# EAGLE design perfScm (EAGLE 9.2.2)
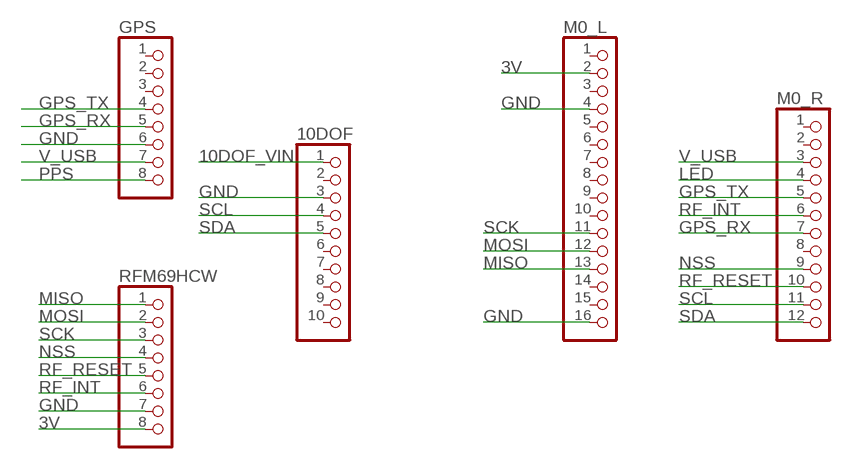
[diagram p0: schematic, sheet 1]

## Parts
10DOF  PINHD-1X10  [1X10]
GPS  PINHD-1X8  [1X08]
M0_L  PINHD-1X16  [1X16]
M0_R  PINHD-1X12  [1X12]
RFM69HCW  PINHD-1X8  [1X08]

## Nets
3V: M0_L.2 RFM69HCW.8
10DOF_VIN: 10DOF.1
GND: 10DOF.3 GPS.6 M0_L.4 M0_L.16 RFM69HCW.7
GPS_RX: GPS.5 M0_R.7
GPS_TX: GPS.4 M0_R.5
LED: M0_R.4
MISO: M0_L.13 RFM69HCW.1
MOSI: M0_L.12 RFM69HCW.2
NSS: M0_R.9 RFM69HCW.4
PPS: GPS.8
RF_INT: M0_R.6 RFM69HCW.6
RF_RESET: M0_R.10 RFM69HCW.5
SCK: M0_L.11 RFM69HCW.3
SCL: 10DOF.4 M0_R.11
SDA: 10DOF.5 M0_R.12
V_USB: GPS.7 M0_R.3
Unconnected: 10DOF.2 10DOF.6 10DOF.7 10DOF.8 10DOF.9 10DOF.10 GPS.1 GPS.2 GPS.3 M0_L.1 M0_L.3 M0_L.5 M0_L.6 M0_L.7 M0_L.8 M0_L.9 M0_L.10 M0_L.14 M0_L.15 M0_R.1 M0_R.2 M0_R.8

## Library data of the parts
10DOF = pinhead:PINHD-1X10: PIN HEADER
GPS RFM69HCW = pinhead:PINHD-1X8: PIN HEADER
M0_L = pinhead:PINHD-1X16: PIN HEADER
M0_R = pinhead:PINHD-1X12: PIN HEADER

## Board
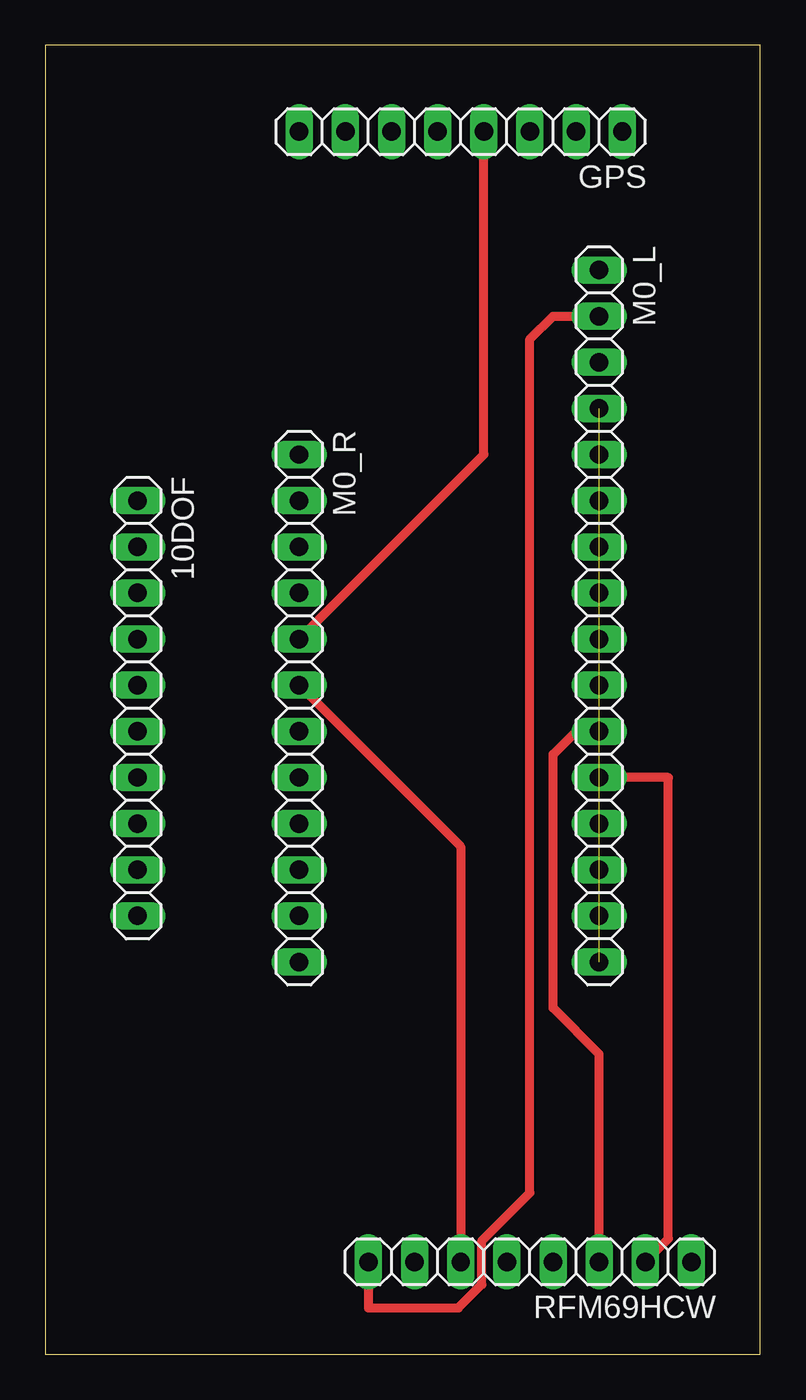
[diagram p1: board, top side]
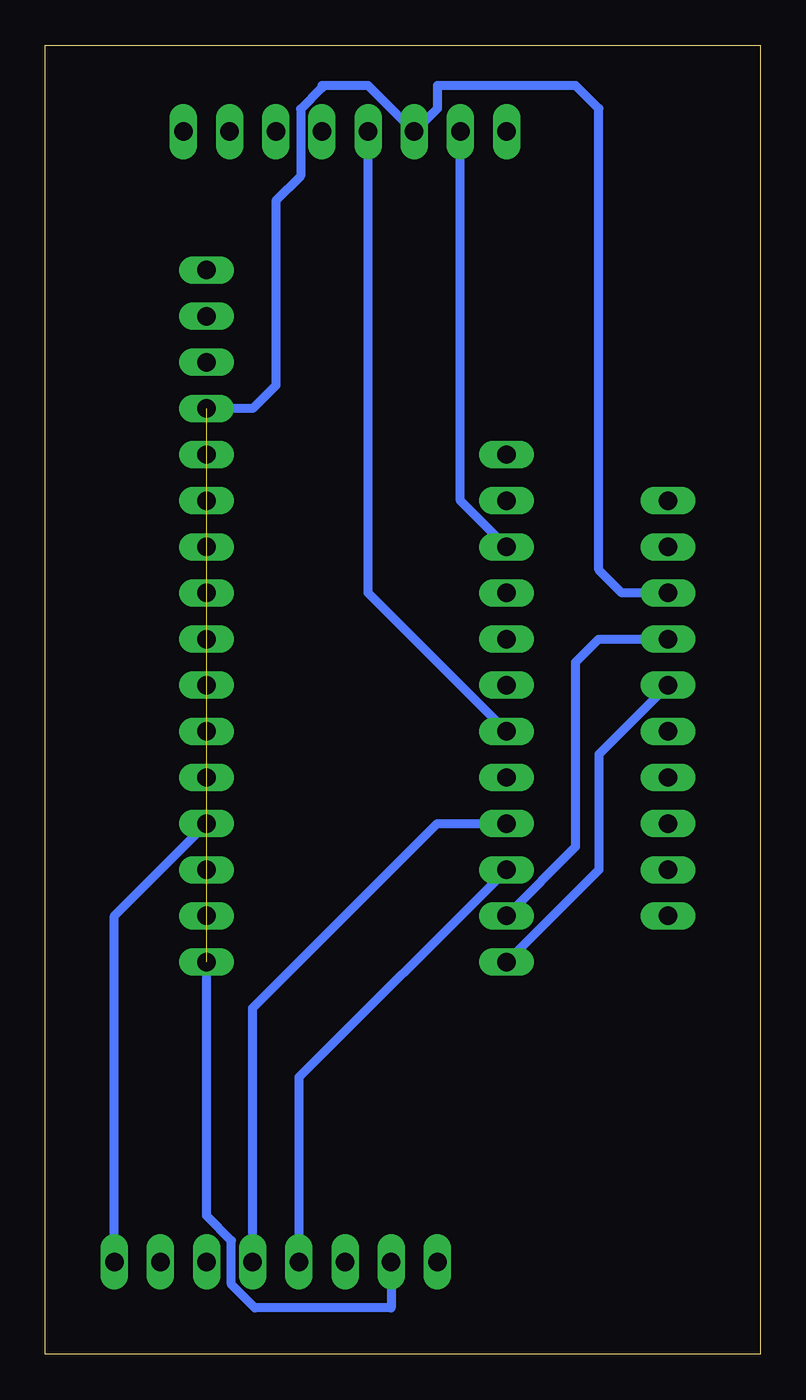
[diagram p2: board, bottom side, seen from below]

Size 39.35 x 72.06 mm. Coordinates in mm from the lower left corner, seen from the top.
Outline: 0,0 39.35,0 39.35,72.06 0,72.06 0,0
Copper layers (1*16): Top 0.035mm / dielectric 1.5mm / Bottom 0.035mm
Design rules "default": minimum track width 6mil, minimum drill 0.35mm, track to track 6mil, track to pad 6mil, pad to pad 6mil, via to via 6mil, smd to smd 6mil, copper to edge 40mil, drill to drill 6mil, minimum pad ring 10mil, minimum via ring 8mil, stop-mask expansion 4mil, vias tented up to drill 0mil, thermal gap 10mil

### Footprints (pad centres in the part's own frame; a part is rotated, then mirrored left to right if it is on the bottom)
1X10 = drill 1.016 long: 1 -11.43,0; 2 -8.89,0; 3 -6.35,0; 4 -3.81,0; 5 -1.27,0; 6 1.27,0; 7 3.81,0; 8 6.35,0; 9 8.89,0; 10 11.43,0
1X08 = drill 1.016 long: 1 -8.89,0; 2 -6.35,0; 3 -3.81,0; 4 -1.27,0; 5 1.27,0; 6 3.81,0; 7 6.35,0; 8 8.89,0
1X16 = drill 1.016 long: 1 -19.05,0; 2 -16.51,0; 3 -13.97,0; 4 -11.43,0; 5 -8.89,0; 6 -6.35,0; 7 -3.81,0; 8 -1.27,0; 9 1.27,0; 10 3.81,0; 11 6.35,0; 12 8.89,0; 13 11.43,0; 14 13.97,0; 15 16.51,0; 16 19.05,0
1X12 = drill 1.016 long: 1 -13.97,0; 2 -11.43,0; 3 -8.89,0; 4 -6.35,0; 5 -3.81,0; 6 -1.27,0; 7 1.27,0; 8 3.81,0; 9 6.35,0; 10 8.89,0; 11 11.43,0; 12 13.97,0

### Placement (x,y rotation side)
10DOF  5.08,35.56 270 top
GPS  22.86,67.31 180 top
M0_L  30.48,40.64 270 top
M0_R  13.97,35.56 270 top
RFM69HCW  26.67,5.08 180 top

### Tracks (layer width: path | path; a pad name or v marks a point on that pad's centre or on a via)
3V
  Top 0.508: RFM69HCW.8 17.78,2.54 22.73,2.54 24.03,3.83 24.03,6.25 26.67,8.89 26.67,55.88 27.94,57.15 M0_L.2
GND  (1 unrouted)
  Bottom 0.508: RFM69HCW.7 20.32,2.54 27.81,2.54 29.11,3.83 29.11,6.25 30.48,7.62 M0_L.16 | M0_L.4 27.94,52.07 26.67,53.34 26.67,63.5 25.3,64.87 25.3,68.56 24.13,69.72 24.13,69.85 21.59,69.85 GPS.6 17.78,68.58 17.78,69.85 10.16,69.85 8.89,68.58 8.89,43.18 7.62,41.91 10DOF.3
GPS_RX
  Bottom 0.508: M0_R.7 21.59,41.91 GPS.5
GPS_TX
  Top 0.508: M0_R.5 24.13,49.53 GPS.4
MISO
  Bottom 0.508: RFM69HCW.1 35.56,24.13 M0_L.13
MOSI
  Top 0.508: RFM69HCW.2 34.29,6.35 34.29,31.75 M0_L.12
NSS
  Bottom 0.508: RFM69HCW.4 27.94,19.05 17.78,29.21 M0_R.9
RF_INT
  Top 0.508: M0_R.6 22.86,27.94 RFM69HCW.6
RF_RESET
  Bottom 0.508: M0_R.10 25.4,15.24 RFM69HCW.5
SCK
  Top 0.508: RFM69HCW.3 30.48,16.51 27.94,19.05 27.94,33.02 29.21,34.29 M0_L.11
SCL
  Bottom 0.508: M0_R.11 10.16,27.94 10.16,38.1 8.89,39.37 10DOF.4
SDA
  Bottom 0.508: 10DOF.5 8.89,33.02 8.89,26.67 M0_R.12
V_USB
  Bottom 0.508: M0_R.3 16.51,46.99 GPS.7